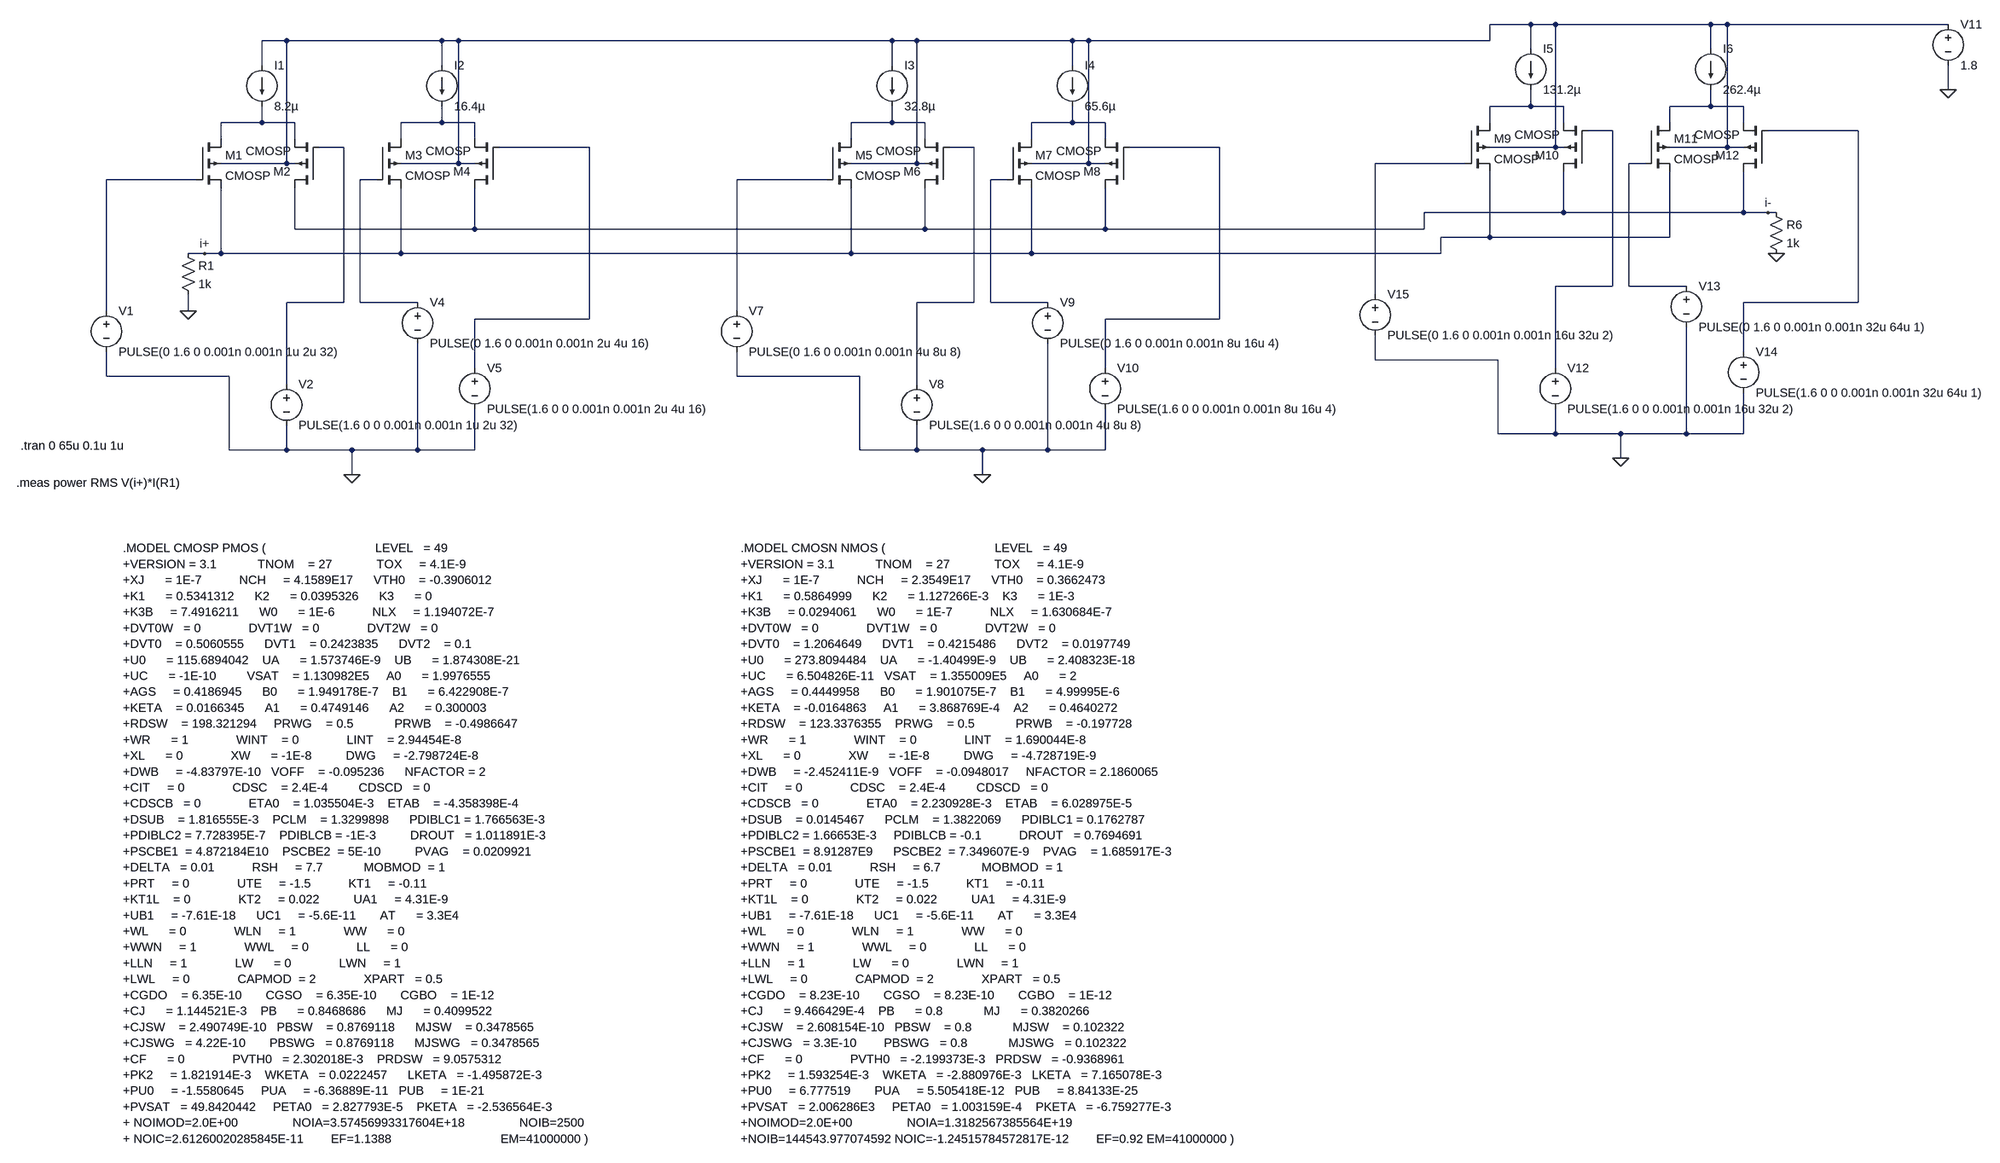
[diagram p0: schematic DAC_idealcurrent.asc]
DAC_idealcurrent.asc, the LTspice schematic file:
Version 4
SHEET 1 3472 2156
WIRE 2528 0 2448 0
WIRE 2576 0 2528 0
WIRE 2880 0 2576 0
WIRE 2912 0 2880 0
WIRE 3344 0 2912 0
WIRE 96 32 48 32
WIRE 400 32 96 32
WIRE 432 32 400 32
WIRE 1280 32 432 32
WIRE 1328 32 1280 32
WIRE 1632 32 1328 32
WIRE 1664 32 1632 32
WIRE 2448 32 2448 0
WIRE 2448 32 1664 32
WIRE 2528 48 2528 0
WIRE 2880 48 2880 0
WIRE 48 80 48 32
WIRE 400 80 400 32
WIRE 1280 80 1280 32
WIRE 1632 80 1632 32
WIRE 3344 128 3344 80
WIRE 2528 160 2528 128
WIRE 2528 160 2448 160
WIRE 2592 160 2528 160
WIRE 2880 160 2880 128
WIRE 2880 160 2800 160
WIRE 2944 160 2880 160
WIRE 48 192 48 160
WIRE 48 192 -32 192
WIRE 112 192 48 192
WIRE 400 192 400 160
WIRE 400 192 320 192
WIRE 464 192 400 192
WIRE 1280 192 1280 160
WIRE 1280 192 1200 192
WIRE 1344 192 1280 192
WIRE 1632 192 1632 160
WIRE 1632 192 1552 192
WIRE 1696 192 1632 192
WIRE 2448 192 2448 160
WIRE 2592 192 2592 160
WIRE 2800 192 2800 160
WIRE 2944 192 2944 160
WIRE 2688 208 2640 208
WIRE 3168 208 2992 208
WIRE -32 224 -32 192
WIRE 112 224 112 192
WIRE 320 224 320 192
WIRE 464 224 464 192
WIRE 1200 224 1200 192
WIRE 1344 224 1344 192
WIRE 1552 224 1552 192
WIRE 1696 224 1696 192
WIRE 208 240 160 240
WIRE 688 240 512 240
WIRE 1440 240 1392 240
WIRE 1920 240 1744 240
WIRE 2576 240 2576 0
WIRE 2576 240 2448 240
WIRE 2592 240 2576 240
WIRE 2912 240 2912 0
WIRE 2912 240 2800 240
WIRE 2944 240 2912 240
WIRE 96 272 96 32
WIRE 96 272 -32 272
WIRE 112 272 96 272
WIRE 432 272 432 32
WIRE 432 272 320 272
WIRE 464 272 432 272
WIRE 1328 272 1328 32
WIRE 1328 272 1200 272
WIRE 1344 272 1328 272
WIRE 1664 272 1664 32
WIRE 1664 272 1552 272
WIRE 1696 272 1664 272
WIRE 2400 272 2224 272
WIRE 2752 272 2720 272
WIRE -80 304 -256 304
WIRE 272 304 240 304
WIRE 1152 304 976 304
WIRE 1504 304 1472 304
WIRE 2592 368 2592 288
WIRE 2592 368 2320 368
WIRE 2944 368 2944 288
WIRE 2944 368 2592 368
WIRE 2992 368 2944 368
WIRE 3008 368 2992 368
WIRE 112 400 112 320
WIRE 464 400 464 320
WIRE 464 400 112 400
WIRE 1344 400 1344 320
WIRE 1344 400 464 400
WIRE 1696 400 1696 320
WIRE 1696 400 1344 400
WIRE 2320 400 2320 368
WIRE 2320 400 1696 400
WIRE 2448 416 2448 288
WIRE 2448 416 2352 416
WIRE 2800 416 2800 288
WIRE 2800 416 2448 416
WIRE -64 448 -96 448
WIRE -32 448 -32 320
WIRE -32 448 -64 448
WIRE 320 448 320 320
WIRE 320 448 -32 448
WIRE 1200 448 1200 320
WIRE 1200 448 320 448
WIRE 1552 448 1552 320
WIRE 1552 448 1200 448
WIRE 2352 448 2352 416
WIRE 2352 448 1552 448
WIRE 2688 512 2688 208
WIRE 2688 512 2576 512
WIRE 2720 512 2720 272
WIRE 2832 512 2720 512
WIRE 2224 528 2224 272
WIRE 208 544 208 240
WIRE 208 544 96 544
WIRE 240 544 240 304
WIRE 352 544 240 544
WIRE 1440 544 1440 240
WIRE 1440 544 1328 544
WIRE 1472 544 1472 304
WIRE 1584 544 1472 544
WIRE 3168 544 3168 208
WIRE 3168 544 2944 544
WIRE -256 560 -256 304
WIRE -96 560 -96 528
WIRE 976 560 976 304
WIRE 688 576 688 240
WIRE 688 576 464 576
WIRE 1920 576 1920 240
WIRE 1920 576 1696 576
WIRE 2944 640 2944 544
WIRE 2224 656 2224 608
WIRE 2464 656 2224 656
WIRE 464 672 464 576
WIRE 1696 672 1696 576
WIRE 2576 672 2576 512
WIRE -256 688 -256 640
WIRE -16 688 -256 688
WIRE 976 688 976 640
WIRE 1216 688 976 688
WIRE 96 704 96 544
WIRE 1328 704 1328 544
WIRE 2464 800 2464 656
WIRE 2576 800 2576 752
WIRE 2576 800 2464 800
WIRE 2704 800 2576 800
WIRE 2832 800 2832 592
WIRE 2832 800 2704 800
WIRE 2944 800 2944 720
WIRE 2944 800 2832 800
WIRE -16 832 -16 688
WIRE 96 832 96 784
WIRE 96 832 -16 832
WIRE 224 832 96 832
WIRE 352 832 352 624
WIRE 352 832 224 832
WIRE 464 832 464 752
WIRE 464 832 352 832
WIRE 1216 832 1216 688
WIRE 1328 832 1328 784
WIRE 1328 832 1216 832
WIRE 1456 832 1328 832
WIRE 1584 832 1584 624
WIRE 1584 832 1456 832
WIRE 1696 832 1696 752
WIRE 1696 832 1584 832
WIRE 2704 848 2704 800
WIRE 224 880 224 832
WIRE 1456 880 1456 832
FLAG -64 448 i+
FLAG -96 560 0
FLAG 224 880 0
FLAG 1456 880 0
FLAG 3344 128 0
FLAG 2992 368 i-
FLAG 3008 448 0
FLAG 2704 848 0
SYMBOL current 48 80 R0
WINDOW 123 0 0 Left 0
WINDOW 39 0 0 Left 0
SYMATTR InstName I1
SYMATTR Value 8.2µ
SYMBOL current 400 80 R0
WINDOW 123 0 0 Left 0
WINDOW 39 0 0 Left 0
SYMATTR InstName I2
SYMATTR Value 16.4µ
SYMBOL res -112 432 R0
SYMATTR InstName R1
SYMATTR Value 1k
SYMBOL pmos4 -80 224 R0
SYMATTR InstName M1
SYMATTR Value CMOSP
SYMATTR Value2 l=0.36u w=1.2u m=1
SYMBOL pmos4 160 320 R180
SYMATTR InstName M2
SYMATTR Value CMOSP
SYMATTR Value2 l=0.36u w=1.2u m=1
SYMBOL pmos4 272 224 R0
SYMATTR InstName M3
SYMATTR Value CMOSP
SYMATTR Value2 l=0.36u w=1.2u m=2
SYMBOL pmos4 512 320 R180
SYMATTR InstName M4
SYMATTR Value CMOSP
SYMATTR Value2 l=0.36u w=1.2u m=2
SYMBOL voltage -256 544 R0
WINDOW 123 0 0 Left 0
WINDOW 39 0 0 Left 0
SYMATTR InstName V1
SYMATTR Value PULSE(0 1.6 0 0.001n 0.001n 1u 2u 32)
SYMBOL voltage 96 688 R0
WINDOW 123 0 0 Left 0
WINDOW 39 0 0 Left 0
SYMATTR InstName V2
SYMATTR Value PULSE(1.6 0 0 0.001n 0.001n 1u 2u 32)
SYMBOL voltage 352 528 R0
WINDOW 123 0 0 Left 0
WINDOW 39 0 0 Left 0
SYMATTR InstName V4
SYMATTR Value PULSE(0 1.6 0 0.001n 0.001n 2u 4u 16)
SYMBOL voltage 464 656 R0
WINDOW 123 0 0 Left 0
WINDOW 39 0 0 Left 0
SYMATTR InstName V5
SYMATTR Value PULSE(1.6 0 0 0.001n 0.001n 2u 4u 16)
SYMBOL current 1280 80 R0
WINDOW 123 0 0 Left 0
WINDOW 39 0 0 Left 0
SYMATTR InstName I3
SYMATTR Value 32.8µ
SYMBOL current 1632 80 R0
WINDOW 123 0 0 Left 0
WINDOW 39 0 0 Left 0
SYMATTR InstName I4
SYMATTR Value 65.6µ
SYMBOL pmos4 1152 224 R0
SYMATTR InstName M5
SYMATTR Value CMOSP
SYMATTR Value2 l=0.36u w=1.2u m=4
SYMBOL pmos4 1392 320 R180
SYMATTR InstName M6
SYMATTR Value CMOSP
SYMATTR Value2 l=0.36u w=1.2u m=4
SYMBOL pmos4 1504 224 R0
SYMATTR InstName M7
SYMATTR Value CMOSP
SYMATTR Value2 l=0.36u w=1.2u m=8
SYMBOL pmos4 1744 320 R180
SYMATTR InstName M8
SYMATTR Value CMOSP
SYMATTR Value2 l=0.36u w=1.2u m=8
SYMBOL voltage 976 544 R0
WINDOW 123 0 0 Left 0
WINDOW 39 0 0 Left 0
SYMATTR InstName V7
SYMATTR Value PULSE(0 1.6 0 0.001n 0.001n 4u 8u 8)
SYMBOL voltage 1328 688 R0
WINDOW 123 0 0 Left 0
WINDOW 39 0 0 Left 0
SYMATTR InstName V8
SYMATTR Value PULSE(1.6 0 0 0.001n 0.001n 4u 8u 8)
SYMBOL voltage 1584 528 R0
WINDOW 123 0 0 Left 0
WINDOW 39 0 0 Left 0
SYMATTR InstName V9
SYMATTR Value PULSE(0 1.6 0 0.001n 0.001n 8u 16u 4)
SYMBOL voltage 1696 656 R0
WINDOW 123 0 0 Left 0
WINDOW 39 0 0 Left 0
SYMATTR InstName V10
SYMATTR Value PULSE(1.6 0 0 0.001n 0.001n 8u 16u 4)
SYMBOL current 2528 48 R0
WINDOW 123 0 0 Left 0
WINDOW 39 0 0 Left 0
SYMATTR InstName I5
SYMATTR Value 131.2µ
SYMBOL current 2880 48 R0
WINDOW 123 0 0 Left 0
WINDOW 39 0 0 Left 0
SYMATTR InstName I6
SYMATTR Value 262.4µ
SYMBOL voltage 3344 -16 R0
WINDOW 123 0 0 Left 0
WINDOW 39 0 0 Left 0
SYMATTR InstName V11
SYMATTR Value 1.8
SYMBOL res 2992 352 R0
SYMATTR InstName R6
SYMATTR Value 1k
SYMBOL pmos4 2400 192 R0
SYMATTR InstName M9
SYMATTR Value CMOSP
SYMATTR Value2 l=0.36u w=1.2u m=16
SYMBOL pmos4 2640 288 R180
SYMATTR InstName M10
SYMATTR Value CMOSP
SYMATTR Value2 l=0.36u w=1.2u m=16
SYMBOL pmos4 2752 192 R0
SYMATTR InstName M11
SYMATTR Value CMOSP
SYMATTR Value2 l=0.36u w=1.2u m=32
SYMBOL pmos4 2992 288 R180
SYMATTR InstName M12
SYMATTR Value CMOSP
SYMATTR Value2 l=0.36u w=1.2u m=32
SYMBOL voltage 2576 656 R0
WINDOW 123 0 0 Left 0
WINDOW 39 0 0 Left 0
SYMATTR InstName V12
SYMATTR Value PULSE(1.6 0 0 0.001n 0.001n 16u 32u 2)
SYMBOL voltage 2832 496 R0
WINDOW 123 0 0 Left 0
WINDOW 39 0 0 Left 0
SYMATTR InstName V13
SYMATTR Value PULSE(0 1.6 0 0.001n 0.001n 32u 64u 1)
SYMBOL voltage 2944 624 R0
WINDOW 123 0 0 Left 0
WINDOW 39 0 0 Left 0
SYMATTR InstName V14
SYMATTR Value PULSE(1.6 0 0 0.001n 0.001n 32u 64u 1)
SYMBOL voltage 2224 512 R0
WINDOW 123 0 0 Left 0
WINDOW 39 0 0 Left 0
SYMATTR InstName V15
SYMATTR Value PULSE(0 1.6 0 0.001n 0.001n 16u 32u 2)
TEXT 984 1104 Left 2 !.MODEL CMOSN NMOS (                                LEVEL   = 49\n+VERSION = 3.1            TNOM    = 27             TOX     = 4.1E-9\n+XJ      = 1E-7           NCH     = 2.3549E17      VTH0    = 0.3662473\n+K1      = 0.5864999      K2      = 1.127266E-3    K3      = 1E-3\n+K3B     = 0.0294061      W0      = 1E-7           NLX     = 1.630684E-7\n+DVT0W   = 0              DVT1W   = 0              DVT2W   = 0\n+DVT0    = 1.2064649      DVT1    = 0.4215486      DVT2    = 0.0197749\n+U0      = 273.8094484    UA      = -1.40499E-9    UB      = 2.408323E-18\n+UC      = 6.504826E-11   VSAT    = 1.355009E5     A0      = 2\n+AGS     = 0.4449958      B0      = 1.901075E-7    B1      = 4.99995E-6\n+KETA    = -0.0164863     A1      = 3.868769E-4    A2      = 0.4640272\n+RDSW    = 123.3376355    PRWG    = 0.5            PRWB    = -0.197728\n+WR      = 1              WINT    = 0              LINT    = 1.690044E-8\n+XL      = 0              XW      = -1E-8          DWG     = -4.728719E-9\n+DWB     = -2.452411E-9   VOFF    = -0.0948017     NFACTOR = 2.1860065\n+CIT     = 0              CDSC    = 2.4E-4         CDSCD   = 0\n+CDSCB   = 0              ETA0    = 2.230928E-3    ETAB    = 6.028975E-5\n+DSUB    = 0.0145467      PCLM    = 1.3822069      PDIBLC1 = 0.1762787\n+PDIBLC2 = 1.66653E-3     PDIBLCB = -0.1           DROUT   = 0.7694691\n+PSCBE1  = 8.91287E9      PSCBE2  = 7.349607E-9    PVAG    = 1.685917E-3\n+DELTA   = 0.01           RSH     = 6.7            MOBMOD  = 1\n+PRT     = 0              UTE     = -1.5           KT1     = -0.11\n+KT1L    = 0              KT2     = 0.022          UA1     = 4.31E-9\n+UB1     = -7.61E-18      UC1     = -5.6E-11       AT      = 3.3E4\n+WL      = 0              WLN     = 1              WW      = 0\n+WWN     = 1              WWL     = 0              LL      = 0\n+LLN     = 1              LW      = 0              LWN     = 1\n+LWL     = 0              CAPMOD  = 2              XPART   = 0.5\n+CGDO    = 8.23E-10       CGSO    = 8.23E-10       CGBO    = 1E-12\n+CJ      = 9.466429E-4    PB      = 0.8            MJ      = 0.3820266\n+CJSW    = 2.608154E-10   PBSW    = 0.8            MJSW    = 0.102322\n+CJSWG   = 3.3E-10        PBSWG   = 0.8            MJSWG   = 0.102322\n+CF      = 0              PVTH0   = -2.199373E-3   PRDSW   = -0.9368961\n+PK2     = 1.593254E-3    WKETA   = -2.880976E-3   LKETA   = 7.165078E-3\n+PU0     = 6.777519       PUA     = 5.505418E-12   PUB     = 8.84133E-25\n+PVSAT   = 2.006286E3     PETA0   = 1.003159E-4    PKETA   = -6.759277E-3\n+NOIMOD=2.0E+00                NOIA=1.3182567385564E+19\n+NOIB=144543.977074592 NOIC=-1.24515784572817E-12        EF=0.92 EM=41000000 )
TEXT -224 1104 Left 2 !.MODEL CMOSP PMOS (                                LEVEL   = 49\n+VERSION = 3.1            TNOM    = 27             TOX     = 4.1E-9\n+XJ      = 1E-7           NCH     = 4.1589E17      VTH0    = -0.3906012\n+K1      = 0.5341312      K2      = 0.0395326      K3      = 0\n+K3B     = 7.4916211      W0      = 1E-6           NLX     = 1.194072E-7\n+DVT0W   = 0              DVT1W   = 0              DVT2W   = 0\n+DVT0    = 0.5060555      DVT1    = 0.2423835      DVT2    = 0.1\n+U0      = 115.6894042    UA      = 1.573746E-9    UB      = 1.874308E-21\n+UC      = -1E-10         VSAT    = 1.130982E5     A0      = 1.9976555\n+AGS     = 0.4186945      B0      = 1.949178E-7    B1      = 6.422908E-7\n+KETA    = 0.0166345      A1      = 0.4749146      A2      = 0.300003\n+RDSW    = 198.321294     PRWG    = 0.5            PRWB    = -0.4986647\n+WR      = 1              WINT    = 0              LINT    = 2.94454E-8\n+XL      = 0              XW      = -1E-8          DWG     = -2.798724E-8\n+DWB     = -4.83797E-10   VOFF    = -0.095236      NFACTOR = 2\n+CIT     = 0              CDSC    = 2.4E-4         CDSCD   = 0\n+CDSCB   = 0              ETA0    = 1.035504E-3    ETAB    = -4.358398E-4\n+DSUB    = 1.816555E-3    PCLM    = 1.3299898      PDIBLC1 = 1.766563E-3\n+PDIBLC2 = 7.728395E-7    PDIBLCB = -1E-3          DROUT   = 1.011891E-3\n+PSCBE1  = 4.872184E10    PSCBE2  = 5E-10          PVAG    = 0.0209921\n+DELTA   = 0.01           RSH     = 7.7            MOBMOD  = 1\n+PRT     = 0              UTE     = -1.5           KT1     = -0.11\n+KT1L    = 0              KT2     = 0.022          UA1     = 4.31E-9\n+UB1     = -7.61E-18      UC1     = -5.6E-11       AT      = 3.3E4\n+WL      = 0              WLN     = 1              WW      = 0\n+WWN     = 1              WWL     = 0              LL      = 0\n+LLN     = 1              LW      = 0              LWN     = 1\n+LWL     = 0              CAPMOD  = 2              XPART   = 0.5\n+CGDO    = 6.35E-10       CGSO    = 6.35E-10       CGBO    = 1E-12\n+CJ      = 1.144521E-3    PB      = 0.8468686      MJ      = 0.4099522\n+CJSW    = 2.490749E-10   PBSW    = 0.8769118      MJSW    = 0.3478565\n+CJSWG   = 4.22E-10       PBSWG   = 0.8769118      MJSWG   = 0.3478565\n+CF      = 0              PVTH0   = 2.302018E-3    PRDSW   = 9.0575312\n+PK2     = 1.821914E-3    WKETA   = 0.0222457      LKETA   = -1.495872E-3\n+PU0     = -1.5580645     PUA     = -6.36889E-11   PUB     = 1E-21\n+PVSAT   = 49.8420442     PETA0   = 2.827793E-5    PKETA   = -2.536564E-3 \n+ NOIMOD=2.0E+00                NOIA=3.57456993317604E+18                NOIB=2500\n+ NOIC=2.61260020285845E-11        EF=1.1388                                EM=41000000 )
TEXT -424 824 Left 2 !.tran 0 65u 0.1u 1u
TEXT -432 896 Left 2 !.meas power RMS V(i+)*I(R1)

The netlist it stands for:
* DAC_idealcurrent.asc
I1 N001 N004 8.2µ
I2 N001 N005 16.4µ
R1 i+ 0 1k
M1 N004 N016 i+ N001 CMOSP l=0.36u w=1.2u m=1
M2 i- N010 N004 N001 CMOSP l=0.36u w=1.2u m=1
M3 N005 N017 i+ N001 CMOSP l=0.36u w=1.2u m=2
M4 i- N011 N005 N001 CMOSP l=0.36u w=1.2u m=2
V1 N016 0 PULSE(0 1.6 0 0.001n 0.001n 1u 2u 32)
V2 N010 0 PULSE(1.6 0 0 0.001n 0.001n 1u 2u 32)
V4 N017 0 PULSE(0 1.6 0 0.001n 0.001n 2u 4u 16)
V5 N011 0 PULSE(1.6 0 0 0.001n 0.001n 2u 4u 16)
I3 N001 N006 32.8µ
I4 N001 N007 65.6µ
M5 N006 N018 i+ N001 CMOSP l=0.36u w=1.2u m=4
M6 i- N012 N006 N001 CMOSP l=0.36u w=1.2u m=4
M7 N007 N019 i+ N001 CMOSP l=0.36u w=1.2u m=8
M8 i- N013 N007 N001 CMOSP l=0.36u w=1.2u m=8
V7 N018 0 PULSE(0 1.6 0 0.001n 0.001n 4u 8u 8)
V8 N012 0 PULSE(1.6 0 0 0.001n 0.001n 4u 8u 8)
V9 N019 0 PULSE(0 1.6 0 0.001n 0.001n 8u 16u 4)
V10 N013 0 PULSE(1.6 0 0 0.001n 0.001n 8u 16u 4)
I5 N001 N002 131.2µ
I6 N001 N003 262.4µ
V11 N001 0 1.8
R6 i- 0 1k
M9 N002 N014 i+ N001 CMOSP l=0.36u w=1.2u m=16
M10 i- N008 N002 N001 CMOSP l=0.36u w=1.2u m=16
M11 N003 N015 i+ N001 CMOSP l=0.36u w=1.2u m=32
M12 i- N009 N003 N001 CMOSP l=0.36u w=1.2u m=32
V12 N008 0 PULSE(1.6 0 0 0.001n 0.001n 16u 32u 2)
V13 N015 0 PULSE(0 1.6 0 0.001n 0.001n 32u 64u 1)
V14 N009 0 PULSE(1.6 0 0 0.001n 0.001n 32u 64u 1)
V15 N014 0 PULSE(0 1.6 0 0.001n 0.001n 16u 32u 2)
.model NMOS NMOS
.model PMOS PMOS
.lib standard.mos
.MODEL CMOSN NMOS (                                LEVEL   = 49
+VERSION = 3.1            TNOM    = 27             TOX     = 4.1E-9
+XJ      = 1E-7           NCH     = 2.3549E17      VTH0    = 0.3662473
+K1      = 0.5864999      K2      = 1.127266E-3    K3      = 1E-3
+K3B     = 0.0294061      W0      = 1E-7           NLX     = 1.630684E-7
+DVT0W   = 0              DVT1W   = 0              DVT2W   = 0
+DVT0    = 1.2064649      DVT1    = 0.4215486      DVT2    = 0.0197749
+U0      = 273.8094484    UA      = -1.40499E-9    UB      = 2.408323E-18
+UC      = 6.504826E-11   VSAT    = 1.355009E5     A0      = 2
+AGS     = 0.4449958      B0      = 1.901075E-7    B1      = 4.99995E-6
+KETA    = -0.0164863     A1      = 3.868769E-4    A2      = 0.4640272
+RDSW    = 123.3376355    PRWG    = 0.5            PRWB    = -0.197728
+WR      = 1              WINT    = 0              LINT    = 1.690044E-8
+XL      = 0              XW      = -1E-8          DWG     = -4.728719E-9
+DWB     = -2.452411E-9   VOFF    = -0.0948017     NFACTOR = 2.1860065
+CIT     = 0              CDSC    = 2.4E-4         CDSCD   = 0
+CDSCB   = 0              ETA0    = 2.230928E-3    ETAB    = 6.028975E-5
+DSUB    = 0.0145467      PCLM    = 1.3822069      PDIBLC1 = 0.1762787
+PDIBLC2 = 1.66653E-3     PDIBLCB = -0.1           DROUT   = 0.7694691
+PSCBE1  = 8.91287E9      PSCBE2  = 7.349607E-9    PVAG    = 1.685917E-3
+DELTA   = 0.01           RSH     = 6.7            MOBMOD  = 1
+PRT     = 0              UTE     = -1.5           KT1     = -0.11
+KT1L    = 0              KT2     = 0.022          UA1     = 4.31E-9
+UB1     = -7.61E-18      UC1     = -5.6E-11       AT      = 3.3E4
+WL      = 0              WLN     = 1              WW      = 0
+WWN     = 1              WWL     = 0              LL      = 0
+LLN     = 1              LW      = 0              LWN     = 1
+LWL     = 0              CAPMOD  = 2              XPART   = 0.5
+CGDO    = 8.23E-10       CGSO    = 8.23E-10       CGBO    = 1E-12
+CJ      = 9.466429E-4    PB      = 0.8            MJ      = 0.3820266
+CJSW    = 2.608154E-10   PBSW    = 0.8            MJSW    = 0.102322
+CJSWG   = 3.3E-10        PBSWG   = 0.8            MJSWG   = 0.102322
+CF      = 0              PVTH0   = -2.199373E-3   PRDSW   = -0.9368961
+PK2     = 1.593254E-3    WKETA   = -2.880976E-3   LKETA   = 7.165078E-3
+PU0     = 6.777519       PUA     = 5.505418E-12   PUB     = 8.84133E-25
+PVSAT   = 2.006286E3     PETA0   = 1.003159E-4    PKETA   = -6.759277E-3
+NOIMOD=2.0E+00                NOIA=1.3182567385564E+19
+NOIB=144543.977074592 NOIC=-1.24515784572817E-12        EF=0.92 EM=41000000 )
.MODEL CMOSP PMOS (                                LEVEL   = 49
+VERSION = 3.1            TNOM    = 27             TOX     = 4.1E-9
+XJ      = 1E-7           NCH     = 4.1589E17      VTH0    = -0.3906012
+K1      = 0.5341312      K2      = 0.0395326      K3      = 0
+K3B     = 7.4916211      W0      = 1E-6           NLX     = 1.194072E-7
+DVT0W   = 0              DVT1W   = 0              DVT2W   = 0
+DVT0    = 0.5060555      DVT1    = 0.2423835      DVT2    = 0.1
+U0      = 115.6894042    UA      = 1.573746E-9    UB      = 1.874308E-21
+UC      = -1E-10         VSAT    = 1.130982E5     A0      = 1.9976555
+AGS     = 0.4186945      B0      = 1.949178E-7    B1      = 6.422908E-7
+KETA    = 0.0166345      A1      = 0.4749146      A2      = 0.300003
+RDSW    = 198.321294     PRWG    = 0.5            PRWB    = -0.4986647
+WR      = 1              WINT    = 0              LINT    = 2.94454E-8
+XL      = 0              XW      = -1E-8          DWG     = -2.798724E-8
+DWB     = -4.83797E-10   VOFF    = -0.095236      NFACTOR = 2
+CIT     = 0              CDSC    = 2.4E-4         CDSCD   = 0
+CDSCB   = 0              ETA0    = 1.035504E-3    ETAB    = -4.358398E-4
+DSUB    = 1.816555E-3    PCLM    = 1.3299898      PDIBLC1 = 1.766563E-3
+PDIBLC2 = 7.728395E-7    PDIBLCB = -1E-3          DROUT   = 1.011891E-3
+PSCBE1  = 4.872184E10    PSCBE2  = 5E-10          PVAG    = 0.0209921
+DELTA   = 0.01           RSH     = 7.7            MOBMOD  = 1
+PRT     = 0              UTE     = -1.5           KT1     = -0.11
+KT1L    = 0              KT2     = 0.022          UA1     = 4.31E-9
+UB1     = -7.61E-18      UC1     = -5.6E-11       AT      = 3.3E4
+WL      = 0              WLN     = 1              WW      = 0
+WWN     = 1              WWL     = 0              LL      = 0
+LLN     = 1              LW      = 0              LWN     = 1
+LWL     = 0              CAPMOD  = 2              XPART   = 0.5
+CGDO    = 6.35E-10       CGSO    = 6.35E-10       CGBO    = 1E-12
+CJ      = 1.144521E-3    PB      = 0.8468686      MJ      = 0.4099522
+CJSW    = 2.490749E-10   PBSW    = 0.8769118      MJSW    = 0.3478565
+CJSWG   = 4.22E-10       PBSWG   = 0.8769118      MJSWG   = 0.3478565
+CF      = 0              PVTH0   = 2.302018E-3    PRDSW   = 9.0575312
+PK2     = 1.821914E-3    WKETA   = 0.0222457      LKETA   = -1.495872E-3
+PU0     = -1.5580645     PUA     = -6.36889E-11   PUB     = 1E-21
+PVSAT   = 49.8420442     PETA0   = 2.827793E-5    PKETA   = -2.536564E-3
+ NOIMOD=2.0E+00                NOIA=3.57456993317604E+18                NOIB=2500
+ NOIC=2.61260020285845E-11        EF=1.1388                                EM=41000000 )
.tran 0 65u 0.1u 1u
.meas power RMS V(i+)*I(R1)
.backanno
.end